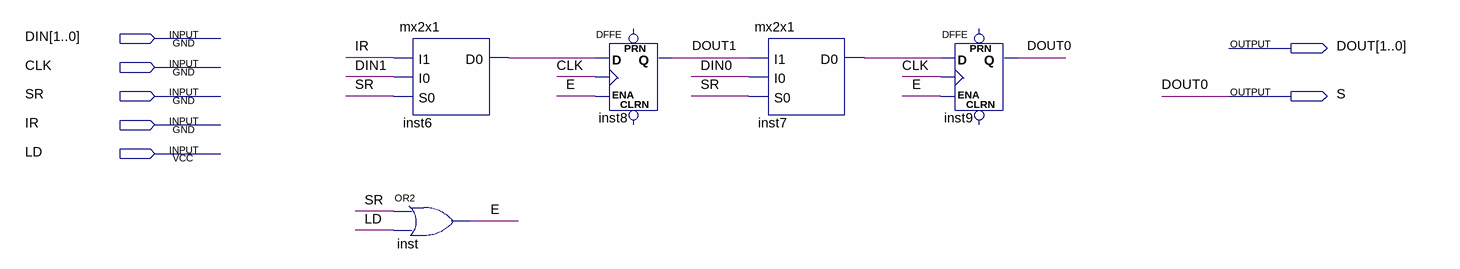
[diagram p0: schematic sheet]
// Quartus schematic reg2_sr_ld.bdf as structural Verilog: 5 symbols, 7 pins
module reg2_sr_ld (
  input  [1:0] DIN,
  input  CLK,
  input  SR,
  input  IR,
  input  LD,
  output [1:0] DOUT,
  output S
);

  wire E, inst6_d0, inst7_d0;

  mx2x1 inst6 (.I1(IR), .I0(DIN[1]), .S0(SR), .D0(inst6_d0));
  or inst (E, SR, LD);
  DFFE inst8 (.D(inst6_d0), .CLK(CLK), .ENA(E), .Q(DOUT[1]));  // open: PRN, CLRN
  mx2x1 inst7 (.I1(DOUT[1]), .I0(DIN[0]), .S0(SR), .D0(inst7_d0));
  DFFE inst9 (.D(inst7_d0), .CLK(CLK), .ENA(E), .Q(DOUT[0]));  // open: PRN, CLRN

  assign S = DOUT[0];
endmodule
